# Altium schematic sheet HANDS_FREE_MotorDrive_V2.SchDoc
size A4
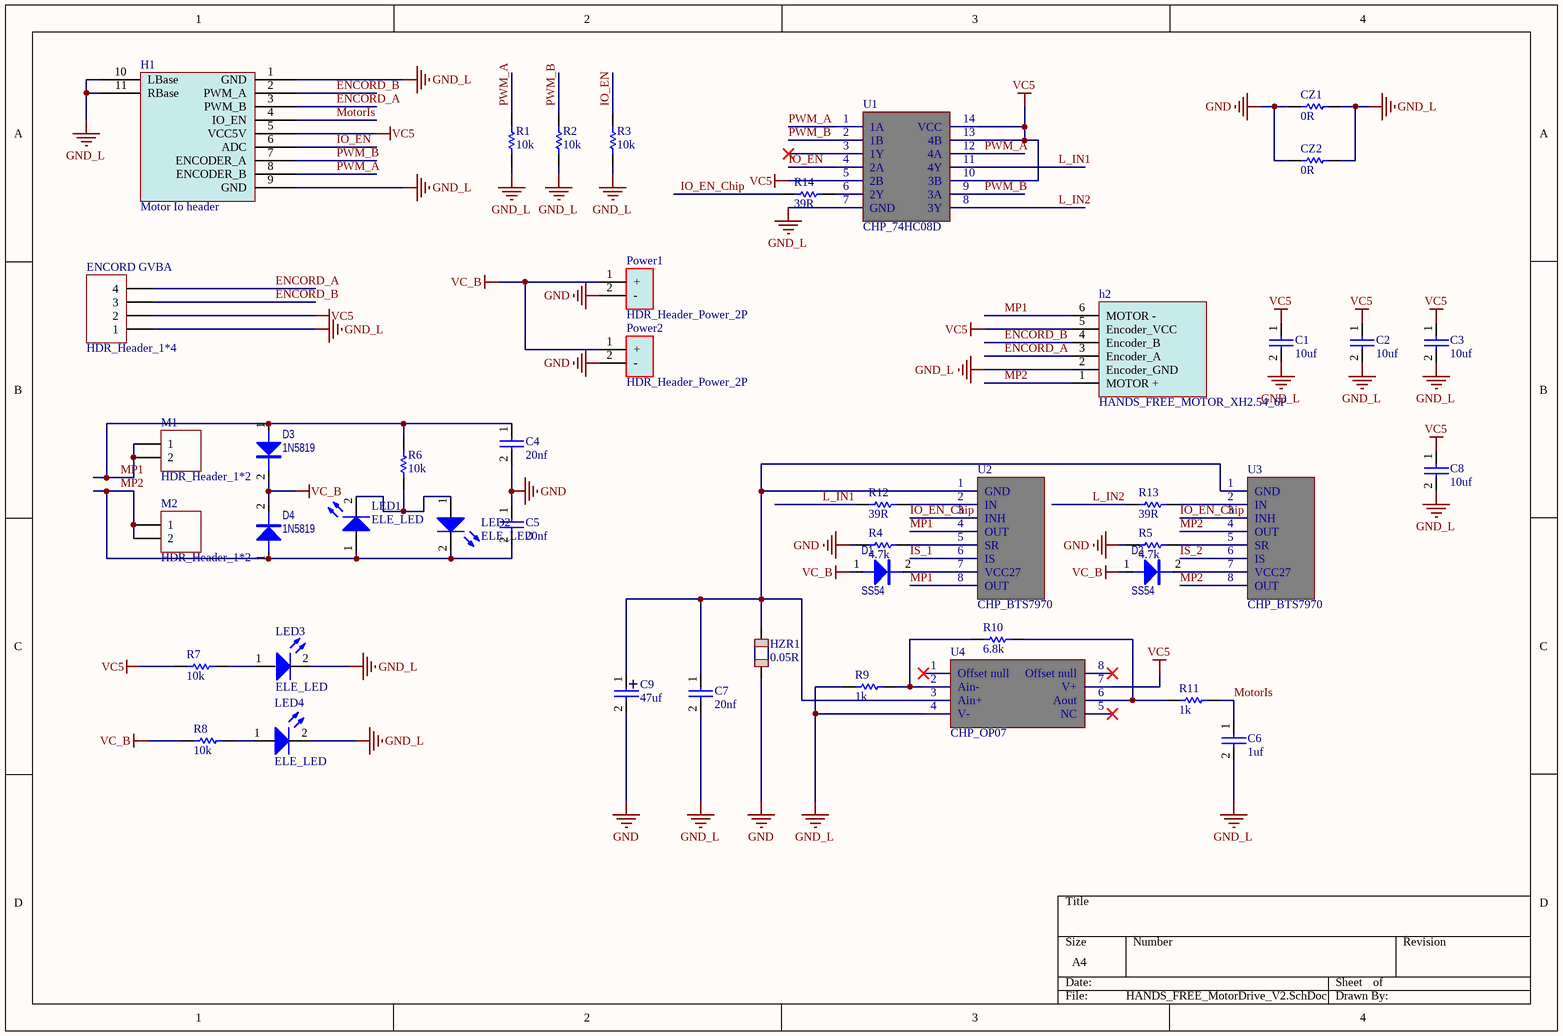
[diagram p0: HANDS_FREE_MotorDrive_V2.SchDoc]

## Parts
C1  10uf  [ELE_0603_P]
C2  10uf  [ELE_0603_P]
C3  10uf  [ELE_0603_P]
C4  20nf  [ELE_0603_P]
C5  20nf  [ELE_0603_P]
C6  1uf  [ELE_0603_P]
C7  20nf  [ELE_0603_P]
C8  10uf  [ELE_0603_P]
C9  47uf  [ELE_CAP_DV_5*X]
CZ1  0R  [ELE_0603_P]
CZ2  0R  [ELE_0603_P]
D1  SS54  [ELE_D1206]
D2  SS54  [ELE_D1206]
D3  1N5819  [ELE_SOD-323]
D4  1N5819  [ELE_SOD-323]
ENCORD_GVBA  HDR_Header_1*4  [HDR_Header_2.54_PH_1*4]
H1  Motor Io header  [HDR_Molex_PH_1.25_9P]
h2  HANDS_FREE_MOTOR_XH2.54_6P  [HDR_Header_XH2.54_DH_1*6]
HZR1  0.05R  [ELE_2512_P]
LED1  ELE_LED  [ELE_0603极性_P]
LED2  ELE_LED  [ELE_0603极性_P]
LED3  ELE_LED  [ELE_0603极性_P]
LED4  ELE_LED  [ELE_0603极性_P]
M1  HDR_Header_1*2  [HDR_H_PH_2P]
M2  HDR_Header_1*2  [HDR_H_PH_2P]
Power1  HDR_Header_Power_2P  [HDR_MOLEX_POWER5557_DH_2P]
Power2  HDR_Header_Power_2P  [HDR_MOLEX_POWER5557_DH_2P]
R1  10k  [ELE_0603_P]
R2  10k  [ELE_0603_P]
R3  10k  [ELE_0603_P]
R4  4.7k  [ELE_0603_P]
R5  4.7k  [ELE_0603_P]
R6  10k  [ELE_0603_P]
R7  10k  [ELE_0603_P]
R8  10k  [ELE_0603_P]
R9  1k  [ELE_0603_P]
R10  6.8k  [ELE_0603_P]
R11  1k  [ELE_0603_P]
R12  39R  [ELE_0603_P]
R13  39R  [ELE_0603_P]
R14  39R  [ELE_0603_P]
U1  CHP_74HC08D  [CHP_SOP_14P]
U2  CHP_BTS7970  [CHP_BTS7970_P-TO-263_7]
U3  CHP_BTS7970  [CHP_BTS7970_P-TO-263_7]
U4  CHP_OP07  [CHP_SOP_8P]

## Nets
GND: C4.2 C5.1 C9.2 CZ1.1 CZ2.1 HZR1.2 Power1.2(-) Power2.2(-) R4.1 R5.1
GND_L: C1.2 C2.2 C3.2 C6.2 C7.2 C8.2 CZ1.2 CZ2.2 ENCORD_GVBA.1 H1.1(GND) H1.9(GND) H1.10(LBase) H1.11(RBase) h2.2(Encoder_GND) LED3.2 LED4.2 R1.2 R2.2 R3.2 R9.1 U1.7(GND) U4.4(V-)
VC5: C1.1 C2.1 C3.1 C8.1 ENCORD_GVBA.2 H1.5(VCC5V) h2.5(Encoder_VCC) R7.2 U1.5(2B) U1.10(3B) U1.13(4B) U1.14(VCC) U4.7(V+)
VC_B: D1.1 D2.1 D3.2 D4.2 Power1.1(+) Power2.1(+) R8.2
ENCORD_A: ENCORD_GVBA.4 H1.3(PWM_B) h2.3(Encoder_A)
ENCORD_B: ENCORD_GVBA.3 H1.2(PWM_A) h2.4(Encoder_B)
IO_EN: H1.6(ADC) R3.1 U1.4(2A)
IO_EN_Chip: R14.1 U2.3(INH) U3.3(INH)
IS_1: U2.6(IS)
IS_2: U3.6(IS)
L_IN1: R12.1 U1.11(4Y)
L_IN2: R13.1 U1.8(3Y)
MotorIs: C6.1 H1.4(IO_EN) R11.2
MP1: C4.1 D3.1 h2.6(MOTOR_-) M1.1 M1.2 R6.2 U2.4(OUT) U2.8(OUT)
MP2: C5.2 D4.1 h2.1(MOTOR_+) LED1.1 LED2.2 M2.1 M2.2 U3.4(OUT) U3.8(OUT)
PWM_A: H1.8(ENCODER_B) R1.1 U1.1(1A) U1.12(4A)
PWM_B: H1.7(ENCODER_A) R2.1 U1.2(1B) U1.9(3A)
NetC7_1: C7.1 C9.1 HZR1.1 U2.1(GND) U3.1(GND) U4.3(Ain+)
NetD1_2: D1.2 U2.7(VCC27)
NetD2_2: D2.2 U3.7(VCC27)
NetLED1_2: LED1.2 LED2.1 R6.1
NetLED3_1: LED3.1 R7.1
NetLED4_1: LED4.1 R8.1
NetR4_2: R4.2 U2.5(SR)
NetR5_2: R5.2 U3.5(SR)
NetR9_2: R9.2 R10.1 U4.2(Ain-)
NetR10_2: R10.2 R11.1 U4.6(Aout)
NetR12_2: R12.2 U2.2(IN)
NetR13_2: R13.2 U3.2(IN)
NetR14_2: R14.2 U1.6(2Y)

Not connected (* = marked no-connect by the designer): U1 3(1Y)*; U4 1(Offset_null)* 5(NC)* 8(Offset_null)*

## Library data of the parts
C1-C8 = ELE_Cap: 电容
C9 = ELE_Cap_Pole: 贴片 极性电容 0603
CZ1 CZ2 R1-R14 = ELE_RES: 贴片 电阻
D1 D2 = ELE_Diode: 贴片 二极管 1206
D3 D4 = ELE_Standard_Diode_SOD323: 贴片 二极管 SOD323
H1 = HANDS_FREE_MOTOR: 卧贴 molex 1.25间距 9P接口
h2 = HANDS_FREE_MOTOR_XH2.54_6P: 直插 XH2.54 卧贴 6P
HZR1 = ELE_RES_HZR: 2512合金电阻 2W
LED1-LED4 = ELE_LED: 发光二极管 0603; Published: 8-Jun-2000; LatestRevisionDate: 17-Jul-2002; LatestRevisionNote: Re-released for DXP Platform.; PackageDocument: Feb-2002; PackageReference: 3.2X1.6X1.1; Publisher: Altium Limited
U1 = CHP_74HC08D: 贴片 CHP_74HC08D芯片 SOP_14P
U4 = CHP_OP07: 贴片 OP07芯片 SOP_8P
ENCORD_GVBA = HDR_Header_1*4: LatestRevisionDate: 17-Jul-2002; LatestRevisionNote: Re-released for DXP Platform.; Publisher: Altium Limited
M1 M2 = HDR_Header_1*2: LatestRevisionDate: 17-Jul-2002; LatestRevisionNote: Re-released for DXP Platform.; Publisher: Altium Limited